# Altium schematic sheet tft_lcd_display.SchDoc: LCD TFT touchscreen & SD card reader
size A4; SheetNumber: 15; SheetTotal: 20; TitleBig: LCD TFT touchscreen & SD card reader; Desc_line1: TIK uses an ILI9341 2.8" TFT LCD display module as a graphic user interface. This module has touchscreen; Desc_line2: capabilities and also integrates a SD card reader on one of its sides. All three elements are managed via SPI.
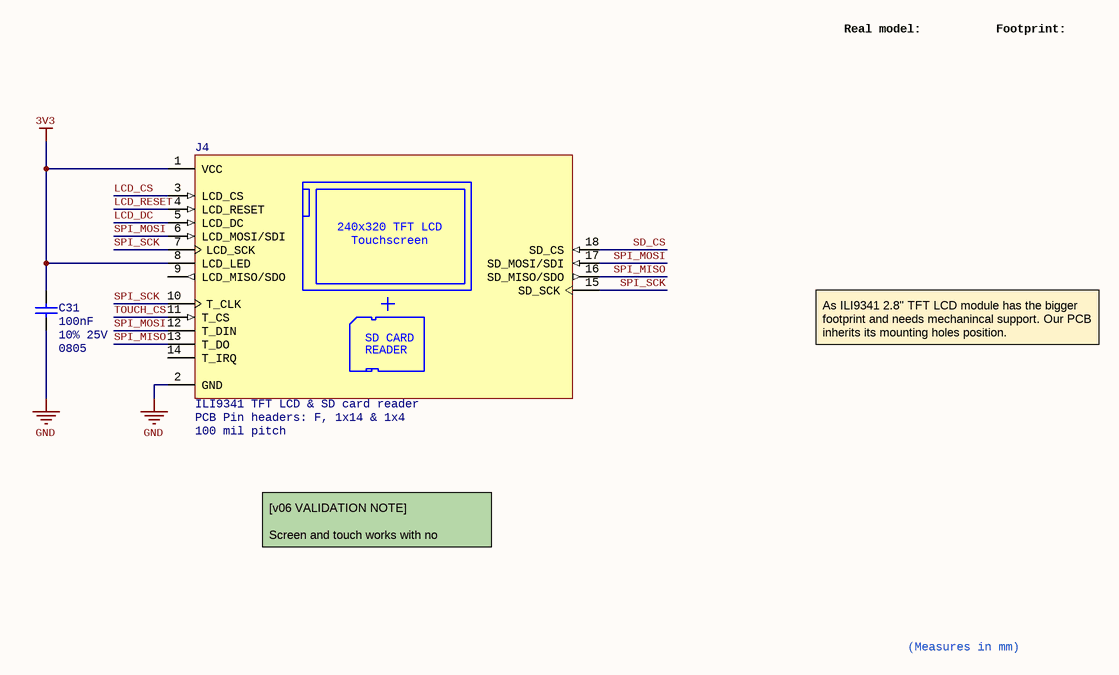
[diagram p0: tft_lcd_display.SchDoc]

## Parts
C31  value 100nF  Tolerance: 10% 25V  PackageDescription: 0805  [CAP 0805_2012]  (hidden comment: Cap_cer_0805)
J4  Part: ILI9341 TFT LCD & SD card reader  Type: PCB Pin headers: F, 1x14 & 1x4  PackageDescription: 100 mil pitch  [ILI9341 2.8" TFT LCD + SD CARD]  (hidden comment: ILI9341 TFT LCD)

## Nets
3V3: C31.2 J4.1(VCC) J4.8(LCD_LED)
GND: C31.1 J4.2(GND)
LCD_CS: J4.3(LCD_CS)
LCD_DC: J4.5(LCD_DC)
LCD_RESET: J4.4(LCD_RESET)
SD_CS: J4.18(SD_CS)
SPI_MISO: J4.13(T_DO) J4.16(SD_MISO/SDO)
SPI_MOSI: J4.6(LCD_MOSI/SDI) J4.12(T_DIN) J4.17(SD_MOSI/SDI)
SPI_SCK: J4.7(LCD_SCK) J4.10(T_CLK) J4.15(SD_SCK)
TOUCH_CS: J4.11(T_CS)

Not connected (* = marked no-connect by the designer): J4 9(LCD_MISO/SDO) 14(T_IRQ)

## Notes on the sheet
- Real model:
- Footprint:
- As ILI9341 2.8" TFT LCD module has the bigger footprint and needs mechanincal support. Our PCB inherits its mounting holes position.
- [v06 VALIDATION NOTE]
  Screen and touch works with no problems.
- (Measures in mm)
- Designer's signature
- Sheet title:
- Sr. Andrés Roldán Aranda
- Supervisor:
- Supervisor's signature
- Project title:
- Desginer:
- Dpto. Electrónica y Tecnología
- de Computadores
- University of Granada
- C/ Fuente Nueva, s/n, 18001
- Granada, Granada, Spain
- Date:
- Revision:
- Sheet
- of
- (in symbol MOD ILI9341 TFT LCD + SD CARD READER) 240x320 TFT LCD; Touchscreen; SD CARD; READER

## Library data of the parts
C31 = Cap_cer_0805_100nF_10%: Ceramic cap size 0805; FabGroup: LCD TFT Display; FabOrder: 15
J4 = MOD ILI9341 TFT LCD + SD CARD READER: ILI9341 TFT LCD Jumper pin headers., plus SD card reader pins; FabGroup: LCD TFT Display; FabOrder: 15